# Altium schematic sheet SchemaAction_Actionneurs.SchDoc: Carte Actionneurs 2024-2025
size A4; DrawnBy: Oriane Doucet; DocumentNumber: 2/2; Revision: V1; SheetNumber: 2; SheetTotal: 2
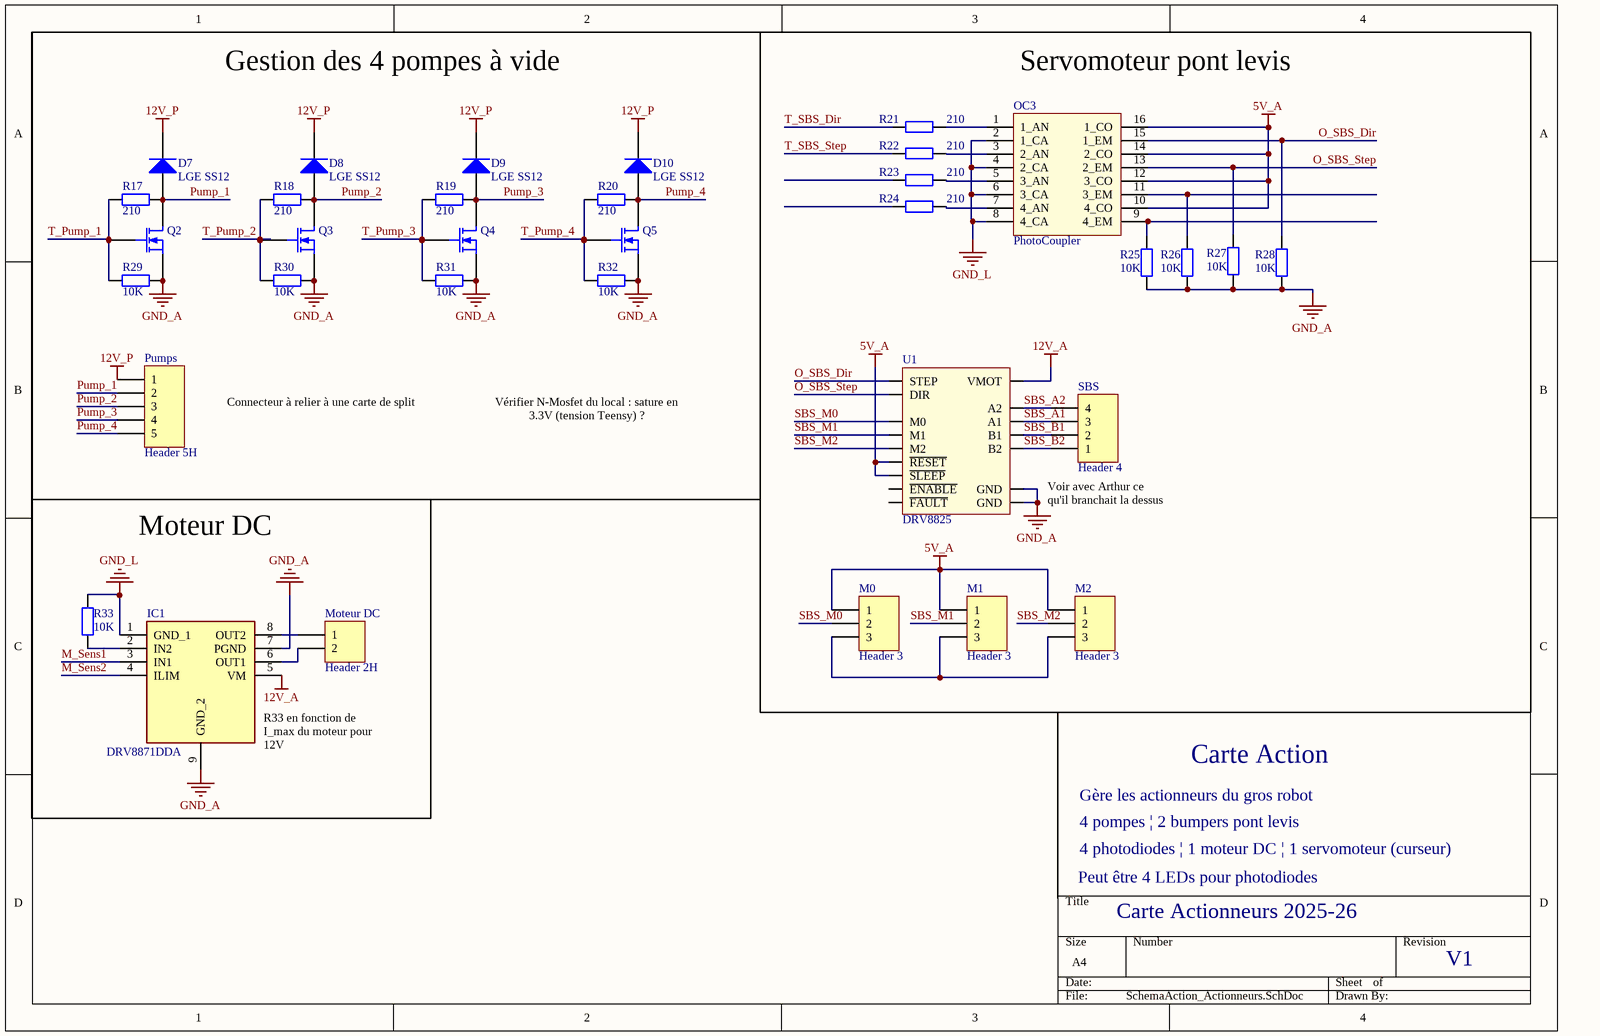
[diagram p0: SchemaAction_Actionneurs.SchDoc]

## Parts
D7  LGE SS12  [SMB]
D8  LGE SS12  [SMB]
D9  LGE SS12  [SMB]
D10  LGE SS12  [SMB]
IC1  DRV8871DDA  [SOIC127P600X170-9N]
M0  Header 3  [HDR1X3]
M1  Header 3  [HDR1X3]
M2  Header 3  [HDR1X3]
Moteur_DC  Header 2H  [HDR1X2H]
OC3  PhotoCoupler  [16 pins SOIC, TI]
Pumps  Header 5H  [HDR1X5H]
Q2  MOSFET-N  [SOT23_M]  (value not drawn)
Q3  MOSFET-N  [SOT23_M]  (value not drawn)
Q4  MOSFET-N  [SOT23_M]  (value not drawn)
Q5  MOSFET-N  [SOT23_M]  (value not drawn)
R17  value 210  [Resistor 1206]  (hidden comment: Res2)
R18  value 210  [Resistor 1206]  (hidden comment: Res2)
R19  value 210  [Resistor 1206]  (hidden comment: Res2)
R20  value 210  [Resistor 1206]  (hidden comment: Res2)
R21  value 210  [Resistor 1206]  (hidden comment: Res2)
R22  value 210  [Resistor 1206]  (hidden comment: Res2)
R23  value 210  [Resistor 1206]  (hidden comment: Res2)
R24  value 210  [Resistor 1206]  (hidden comment: Res2)
R25  value 10K  [Resistor 1206]  (hidden comment: Res2)
R26  value 10K  [Resistor 1206]  (hidden comment: Res2)
R27  value 10K  [Resistor 1206]  (hidden comment: Res2)
R28  value 10K  [Resistor 1206]  (hidden comment: Res2)
R29  value 10K  [Resistor 1206]  (hidden comment: Res2)
R30  value 10K  [Resistor 1206]  (hidden comment: Res2)
R31  value 10K  [Resistor 1206]  (hidden comment: Res2)
R32  value 10K  [Resistor 1206]  (hidden comment: Res2)
R33  value 10K  [Resistor 1206]  (hidden comment: Res2)
SBS  Header 4  [S4B-XH-A]
U1  DRV8825  [DRV8825]

## Nets
5V_A: M0.1 M1.1 M2.1 OC3.10(4_CO) OC3.12(3_CO) OC3.14(2_CO) OC3.16(1_CO) U1.5(~{RESET}) U1.6(~{SLEEP})
12V_A: IC1.5(VM) U1.16(VMOT)
12V_P: D7.2(K) D8.2(K) D9.2(K) D10.2(K) Pumps.1
GND_A: IC1.7(PGND) IC1.9(GND_2) Q2.3(S) Q3.3(S) Q4.3(S) Q5.3(S) R25.1 R26.1 R27.1 R28.1 R29.2 R30.2 R31.2 R32.2 U1.9(GND) U1.15(GND)
GND_L: IC1.1(GND_1) OC3.2(1_CA) OC3.4(2_CA) OC3.6(3_CA) OC3.8(4_CA) R33.2
M_Sens1: IC1.3(IN1)
M_Sens2: IC1.4(ILIM)
O_SBS_Dir: OC3.15(1_EM) R28.2 U1.7(STEP)
O_SBS_Step: OC3.13(2_EM) R27.2 U1.8(DIR)
Pump_1: D7.1(A) Pumps.2 Q2.1(D) R17.2
Pump_2: D8.1(A) Pumps.3 Q3.1(D) R18.2
Pump_3: D9.1(A) Pumps.4 Q4.1(D) R19.2
Pump_4: D10.1(A) Pumps.5 Q5.1(D) R20.2
SBS_A1: SBS.3 U1.12(A1)
SBS_A2: SBS.4 U1.11(A2)
SBS_B1: SBS.2 U1.13(B1)
SBS_B2: SBS.1 U1.14(B2)
SBS_M0: M0.2 U1.2(M0)
SBS_M1: M1.2 U1.3(M1)
SBS_M2: M2.2 U1.4(M2)
T_Pump_1: Q2.2(G) R17.1 R29.1
T_Pump_2: Q3.2(G) R18.1 R30.1
T_Pump_3: Q4.2(G) R19.1 R31.1
T_Pump_4: Q5.2(G) R20.1 R32.1
T_SBS_Dir: R21.2
T_SBS_Step: R22.2
NetIC1_2: IC1.2(IN2) R33.1
NetIC1_6: IC1.6(OUT1) Moteur_DC.2
NetIC1_8: IC1.8(OUT2) Moteur_DC.1
NetM0_3: M0.3 M1.3 M2.3
NetOC3_1: OC3.1(1_AN) R21.1
NetOC3_3: OC3.3(2_AN) R22.1
NetOC3_5: OC3.5(3_AN) R23.1
NetOC3_7: OC3.7(4_AN) R24.1
NetOC3_9: OC3.9(4_EM) R25.2
NetOC3_11: OC3.11(3_EM) R26.2

Not connected (* = marked no-connect by the designer): R23 2; R24 2; U1 1(~{ENABLE}) 10(~{FAULT})

## Notes on the sheet
- Gestion des 4 pompes à vide
- (near OC3) Servomoteur pont levis
- Connecteur à relier à une carte de split
- Vérifier N-Mosfet du local : sature en 3.3V (tension Teensy) ?
- Voir avec Arthur ce qu'il branchait la dessus
- Moteur DC
- (near IC1) R33 en fonction de I_max du moteur pour 12V
- Carte Action
- 4 pompes | 2 bumpers pont levis
- 4 photodiodes | 1 moteur DC | 1 servomoteur (curseur)
- Gère les actionneurs du gros robot
- Peut être 4 LEDs pour photodiodes
- Carte Actionneurs 2025-26

## Library data of the parts
D7-D10 = Diode: Default Diode; Published: 8-Jun-2000; LatestRevisionDate: 17-Jul-2002; LatestRevisionNote: Re-released for DXP Platform.; PackageVersion: Sep-1996; PackageReference: SMC; Publisher: Altium Limited; PackageDescription: DO-214-AB/SMC; 2 C-Bend Leads; Body 7.9 x 5.9 mm, inc. leads (LxW); Code_JEDEC: DO-214-AB
IC1 = DRV8871DDA: Integrated Circuit; Manufacturer_Name: Texas Instruments; Datasheet Link: http://www.ti.com/lit/ds/symlink/drv8871.pdf; Height: 1.7mm; Manufacturer_Part_Number: DRV8871DDA; Mouser Part Number: 595-DRV8871DDA; Mouser Price/Stock: https://www.mouser.co.uk/ProductDetail/Texas-Instruments/DRV8871DDA?qs=Fobv33ltQGiluwfB07aSBw%3D%3D; Arrow Part Number: DRV8871DDA; Arrow Price/Stock: https://www.arrow.com/en/products/drv8871dda/texas-instruments?utm_currency=USD&region=nac
M0-M2 = Header 3: Header, 3-Pin; LatestRevisionDate: 17-Jul-2002; LatestRevisionNote: Re-released for DXP Platform.; Publisher: Altium Limited
Moteur_DC = Header 2H: Header, 2-Pin, Right Angle; LatestRevisionDate: 17-Jul-2002; LatestRevisionNote: Re-released for DXP Platform.; Publisher: Altium Limited
OC3 = LTV-247: Integrated Circuit; Manufacturer_Name: Lite-On; Datasheet Link: http://optoelectronics.liteon.com/upload/download/DS70-2009-0014/LTV-2X7%20sereis%20Mar17.PDF; Manufacturer_Part_Number: LTV-247; Mouser Part Number: 859-LTV-247; Mouser Price/Stock: https://www.mouser.co.uk/ProductDetail/Lite-On/LTV-247/?qs=9ayhpukWNmvWpoxQBzWkFA%3D%3D; Arrow Part Number: LTV-247; Arrow Price/Stock: https://www.arrow.com/en/products/ltv-247/lite-on-technology
Pumps = Header 5H: Header, 5-Pin, Right Angle; LatestRevisionDate: 17-Jul-2002; LatestRevisionNote: Re-released for DXP Platform.; Publisher: Altium Limited
Q2-Q5 = MOSFET-N: N-Channel MOSFET; pin to pad: 2>3 3>2; Published: 8-Jun-2000; LatestRevisionDate: 17-Jul-2002; LatestRevisionNote: Re-released for DXP Platform.; PackageVersion: 1995/1996; PackageReference: E3; Publisher: Altium Limited; PackageDescription: TO, Flat Index; 3 In-Line, Axial Leads; Body Dia. 4.6mm; Lead Dia. 0.5 mm (max)
R17-R33 = Res2: Resistor; Published: 8-Jun-2000; LatestRevisionDate: 17-Jul-2002; LatestRevisionNote: Re-released for DXP Platform.; PackageReference: AXIAL-0.4; Publisher: Altium Limited; PackageDescription: Axial Device, Thru-Hole; 2 Leads; 0.4 in Pin Spacing
SBS = Header 4: Header, 4-Pin; LatestRevisionDate: 17-Jul-2002; LatestRevisionNote: Re-released for DXP Platform.; Publisher: Altium Limited
U1 = DRV8825: Stepper Driver Module